# Altium schematic sheet Current_Sensor_Circuit.SchDoc
size A; SheetNumber: 4; SheetTotal: 7
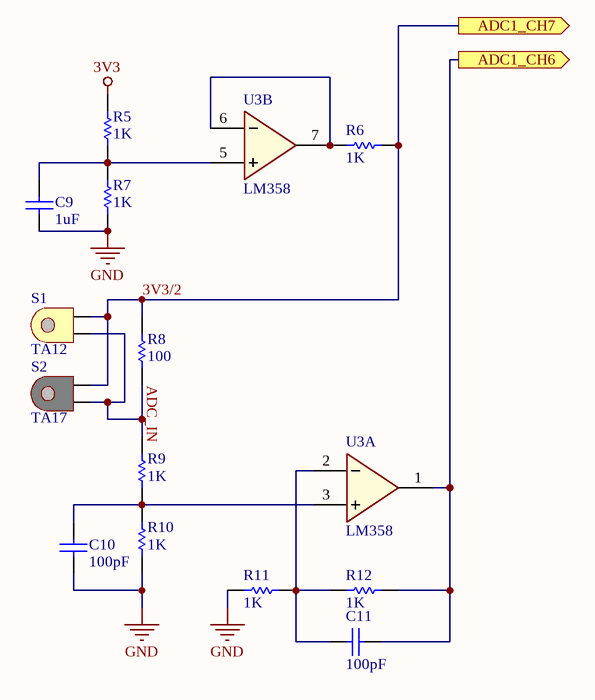
[diagram p0: Current_Sensor_Circuit.SchDoc]

## Parts
C9  value 1uF  (hidden comment: Capacitor)
C10  value 100pF  (hidden comment: Capacitor)
C11  value 100pF  (hidden comment: Capacitor)
R5  value 1K  (hidden comment: Resistor)
R6  value 1K  (hidden comment: Resistor)
R7  value 1K  (hidden comment: Resistor)
R8  value 100  (hidden comment: Resistor)
R9  value 1K  (hidden comment: Resistor)
R10  value 1K  (hidden comment: Resistor)
R11  value 1K  (hidden comment: Resistor)
R12  value 1K  (hidden comment: Resistor)
S1  TA12  [TA12]
S2  TA17  [TA17]
U3  LM358  [SOIC-8]  (parts A,B of 2)

## Ports
ADC1_CH6 (out, see ESP32_WROM_32[2B]), ADC1_CH7 (out, see ESP32_WROM_32[2B])

## Nets
3V3: R5.1
GND: C9.1 C10.1 R7.1 R10.1 R11.1 U3.4(GND)
VCC: U3.8(VCC)
ADC1_CH6: C11.2 R12.2 U3.1(OutA) ; port ADC1_CH6
ADC1_CH7: R6.2 R8.2 S1.2 S2.2 ; port ADC1_CH7
NetC9_2: C9.2 R5.2 R7.2 U3.5(B+)
NetC10_2: C10.2 R9.1 R10.2 U3.3(A+)
NetC11_1: C11.1 R11.2 R12.1 U3.2(A-)
NetR6_1: R6.1 U3.6(B-) U3.7(OutB)
NetR8_1: R8.1 R9.2 S1.1 S2.1

## Notes on the sheet
- (near R8) 3V3/2
- ADC_IN

## Library data of the parts
C9-C11 = Capacitor: SimulationGenericComponent: True
R5-R12 = Resistor: TC1: 0; SimulationGenericComponent: True; TC2: 0
U3 = LM358: Low Power Dual Operational Amplifiers